# EAGLE schematic bbwmixer (EAGLE 9.6.2)
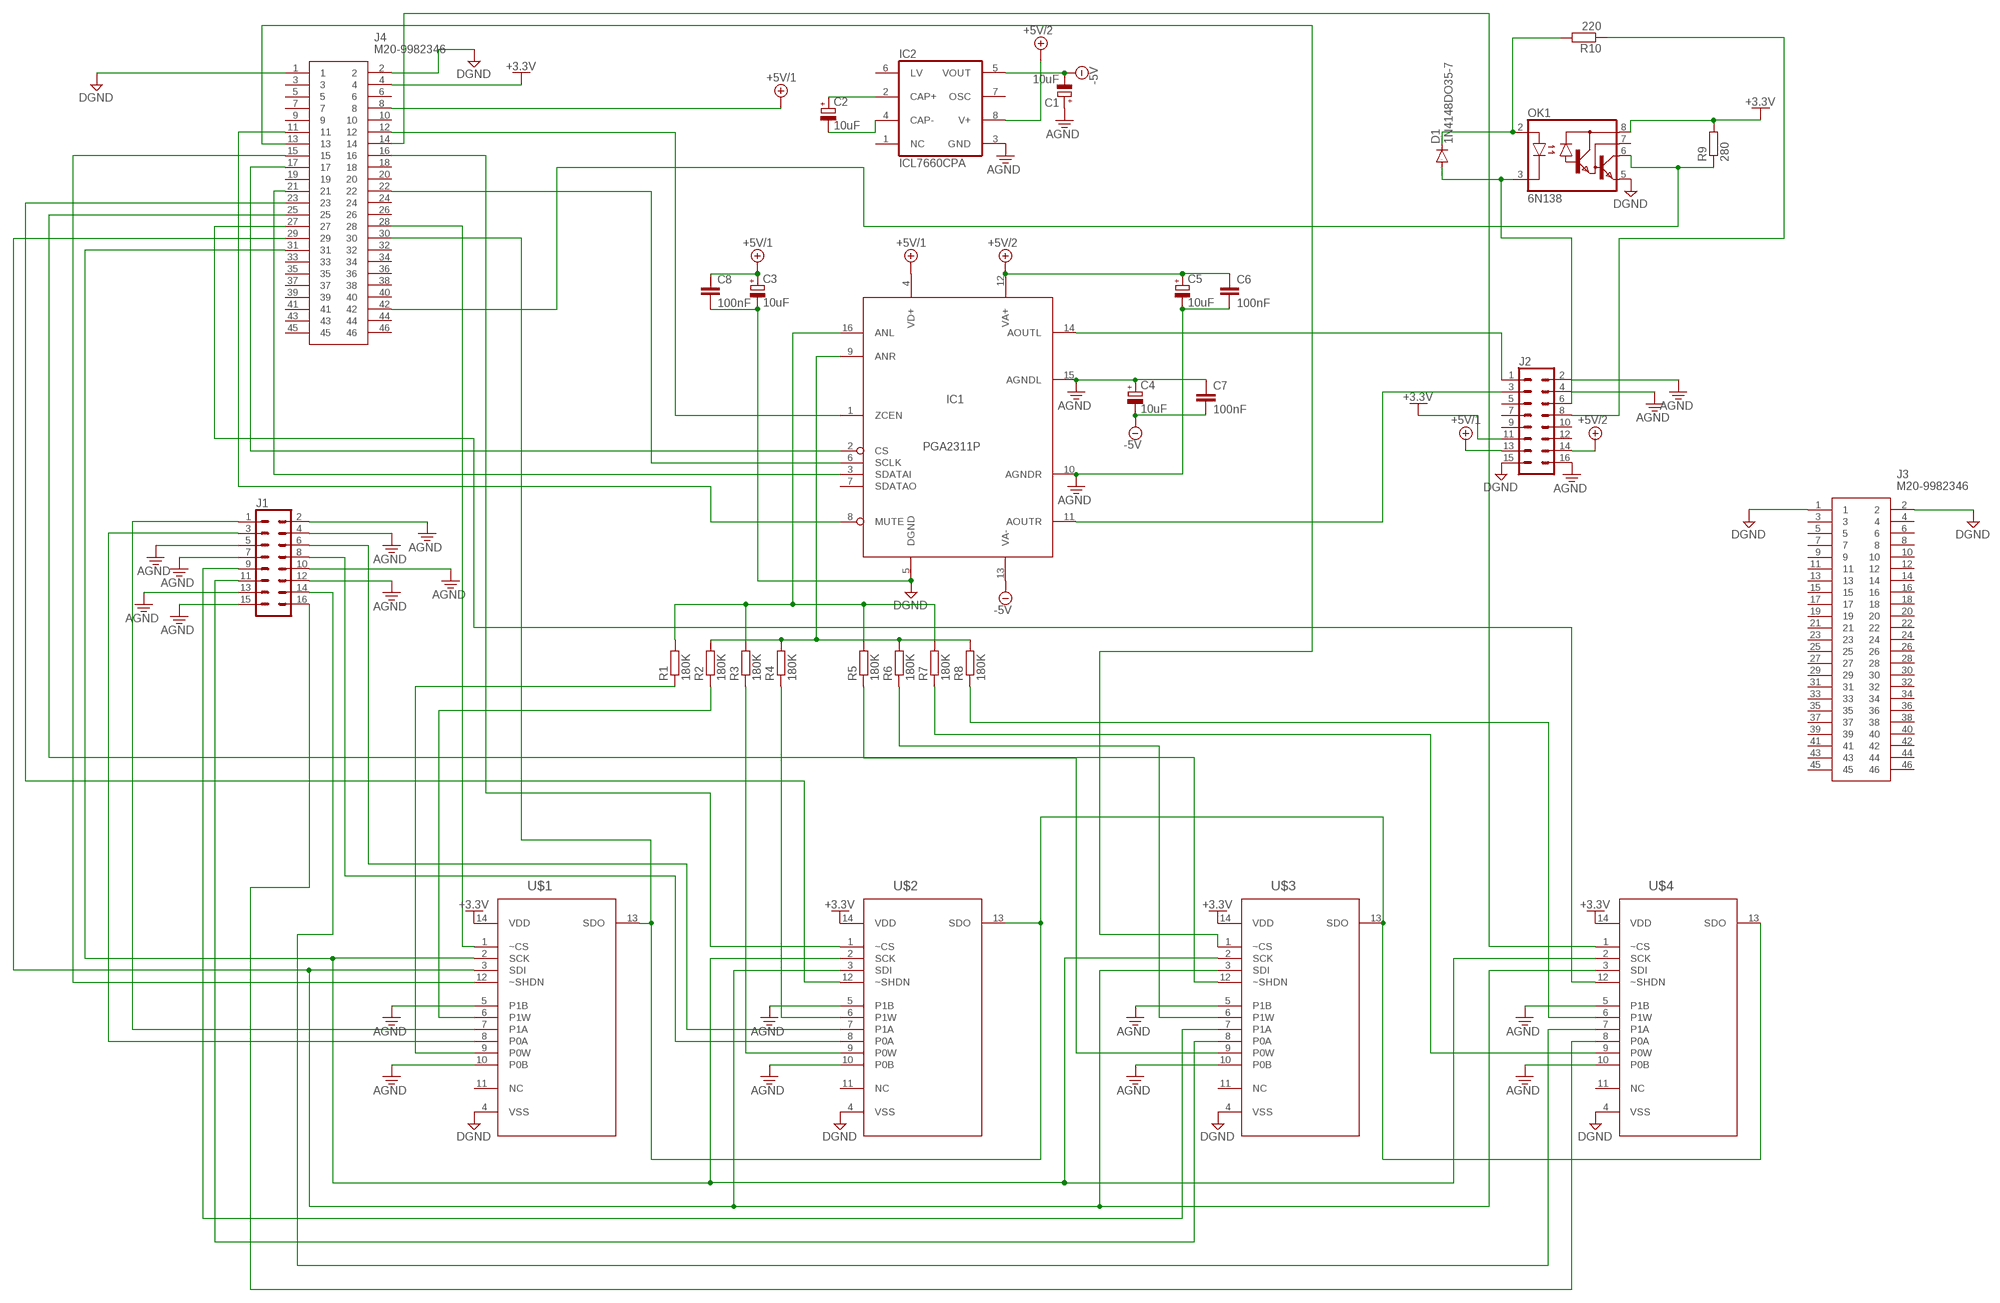
[diagram p0: schematic, sheet 1]

## Parts
C1  10uF  CPOL-EUE15-5AXIAL  [E15-5]
C2  10uF  CPOL-EUE15-5AXIAL  [E15-5]
C3  10uF  CPOL-EUE15-5AXIAL  [E15-5]
C4  10uF  CPOL-EUE15-5AXIAL  [E15-5]
C5  10uF  CPOL-EUE15-5AXIAL  [E15-5]
C6  100nF  C-EU050-025X075  [C050-025X075]
C7  100nF  C-EU050-025X075  [C050-025X075]
C8  100nF  C-EU050-025X075  [C050-025X075]
D1  1N4148DO35-7  [DO35-7]
IC1  PGA2311P  [DIL16]
IC2  ICL7660CPA  [DIL08]
J1  CONN_08X2  [2X8]
J2  CONN_08X2  [2X8]
J3  M20-9982346  [M20-9982346]
J4  M20-9982346  [M20-9982346]
OK1  6N138  [DIL08]
R1  180K  R-EU_0207/10  [0207/10]
R2  180K  R-EU_0207/10  [0207/10]
R3  180K  R-EU_0207/10  [0207/10]
R4  180K  R-EU_0207/10  [0207/10]
R5  180K  R-EU_0207/10  [0207/10]
R6  180K  R-EU_0207/10  [0207/10]
R7  180K  R-EU_0207/10  [0207/10]
R8  180K  R-EU_0207/10  [0207/10]
R9  280  R-EU_0207/10  [0207/10]
R10  220  R-EU_0207/10  [0207/10]
U$1  MCP4251-103E/P  [DIP254P762X533-14]
U$2  MCP4251-103E/P  [DIP254P762X533-14]
U$3  MCP4251-103E/P  [DIP254P762X533-14]
U$4  MCP4251-103E/P  [DIP254P762X533-14]

## Nets
+3.3V: J2.11 J4.4 OK1.8(VCC) R9.2 U$1.14(VDD) U$2.14(VDD) U$3.14(VDD) U$4.14(VDD)
+5V/1: C3.+ C8.1 IC1.4(VD+) J2.13 J4.8
+5V/2 [gordos]: IC1.12(VA+) IC2.8(V+) J2.14
-5V [gordos]: C1.- C4.- C7.2 IC1.13(VA-) IC2.5(VOUT)
AGND [gordos]: C1.+ C4.+ C5.- C6.2 C7.1 IC1.10(AGNDR) IC1.15(AGNDL) IC2.3(GND) J1.2 J1.4 J1.5 J1.7 J1.10 J1.12 J1.13 J1.15 J2.2 J2.4 J2.16 U$1.5(P1B) U$1.10(P0B) U$2.5(P1B) U$2.10(P0B) U$3.5(P1B) U$3.10(P0B) U$4.5(P1B) U$4.10(P0B)
DGND [gordos]: C3.- C8.2 IC1.5(DGND) J2.15 J3.1 J3.2 J4.1 J4.2 OK1.5(GND) U$1.4(VSS) U$2.4(VSS) U$3.4(VSS) U$4.4(VSS)
N$1: C2.+ IC2.2(CAP+)
N$2: C2.- IC2.4(CAP-)
N$4: C5.+ C6.1
N$5: R1.1 U$1.9(P0W)
N$6: R2.1 U$1.6(P1W)
N$7: R3.1 U$2.9(P0W)
N$8: R4.1 U$2.6(P1W)
N$9: R5.1 U$3.9(P0W)
N$10: R6.1 U$3.6(P1W)
N$11: R7.1 U$4.9(P0W)
N$12: R8.1 U$4.6(P1W)
N$13: IC1.16(ANL) R1.2 R3.2 R5.2 R7.2
N$14: IC1.9(ANR) R2.2 R4.2 R6.2 R8.2
N$15: J4.30 U$1.13(SDO) U$2.13(SDO) U$3.13(SDO) U$4.13(SDO)
N$16: J4.31 U$1.2(SCK) U$2.2(SCK) U$3.2(SCK) U$4.2(SCK)
N$17: J1.3 U$1.8(P0A)
N$18: J4.29 U$1.3(SDI) U$2.3(SDI) U$3.3(SDI) U$4.3(SDI)
N$19: J1.1 U$1.7(P1A)
N$20: J1.8 U$2.8(P0A)
N$21: J1.6 U$2.7(P1A)
N$22: J1.9 U$3.7(P1A)
N$23: J1.11 U$3.8(P0A)
N$24: J1.14 U$4.7(P1A)
N$25: J1.16 U$4.8(P0A)
N$26: IC1.14(AOUTL) J2.1
N$27: IC1.11(AOUTR) J2.3
N$30: IC1.2(CS) J4.17
N$31: IC1.3(SDATAI) J4.21
N$32: IC1.6(SCLK) J4.22
N$33: IC1.8(MUTE) J4.11
N$34: IC1.1(ZCEN) J4.12
N$35: J4.15 U$1.12(~SHDN)
N$36: J4.23 U$2.12(~SHDN)
N$37: J4.25 U$3.12(~SHDN)
N$38: J4.27 U$4.12(~SHDN)
N$39: J4.28 U$1.1(~CS)
N$40: J4.16 U$2.1(~CS)
N$41: J4.13 U$3.1(~CS)
N$42: J4.14 U$4.1(~CS)
N$45: J4.42 OK1.6(VO) R9.1
N$46: D1.A J2.6 OK1.3(C)
N$47: D1.C OK1.2(A) R10.2
N$49: J2.8 R10.1
Unconnected: IC1.7(SDATAO) IC2.1(NC) IC2.6(LV) IC2.7(OSC) J2.5 J2.7 J2.9 J2.10 J2.12 J3.3 J3.4 J3.5 J3.6 J3.7 J3.8 J3.9 J3.10 J3.11 J3.12 J3.13 J3.14 J3.15 J3.16 J3.17 J3.18 J3.19 J3.20 J3.21 J3.22 J3.23 J3.24 J3.25 J3.26 J3.27 J3.28 J3.29 J3.30 J3.31 J3.32 J3.33 J3.34 J3.35 J3.36 J3.37 J3.38 J3.39 J3.40 J3.41 J3.42 J3.43 J3.44 J3.45 J3.46 J4.3 J4.5 J4.6 J4.7 J4.9 J4.10 J4.18 J4.19 J4.20 J4.24 J4.26 J4.32 J4.33 J4.34 J4.35 J4.36 J4.37 J4.38 J4.39 J4.40 J4.41 J4.43 J4.44 J4.45 J4.46 OK1.7(VB) U$1.11(NC) U$2.11(NC) U$3.11(NC) U$4.11(NC)

## Library data of the parts
C1-C5 = rcl:CPOL-EU: POLARIZED CAPACITOR, European symbol; SPICEPREFIX: C
C6-C8 = rcl:C-EU: CAPACITOR, European symbol; SPICEPREFIX: C
D1 = diode:1N4148: DIODE high speed (Philips)
IC1 = PGA2311:PGA2311
IC2 = maxim:ICL7660CPA: VOLTAGE CONVERTER; MF: INTERSIL; MPN: ICL7660CPA; OC_FARNELL: 1018170; OC_NEWARK: 06F7441
J1 J2 = SparkFun-Connectors:CONN_08X2: Multi connection point. Often used as Generic Header-pin footprint for 0.1 inch spaced/style header connections You can populate with any combo of single row headers, but if you'd like an exact match, check this: Header - 2x8 (Male, 0.1") <https://www.sparkfun.com/products/13156> (PRT-13156) On any of the 0.1 inch spaced packages, you can populate with these: Break Away Headers - Straight <https://www.sparkfun.com/products/116> (PRT-00116) Break Away Male Headers - Right Angle <https://www.sparkfun.com/products/553> (PRT-00553) Female Headers <https://www.sparkfun.com/products/115> (PRT-00115) Break Away Headers - Machine Pin <https://www.sparkfun.com/products/117> (PRT-00117) Break Away Female Headers - Swiss Machine Pin <https://www.sparkfun.com/products/743> (PRT-00743)
J3 J4 = SamacSys_Parts:M20-9982346: 2.54mm (0.1") Pitch DIL Vertical Throughboard Pin Header, 6.1mm mating pin height, tin, 23+23 contacts Source: Datasheet <https://cdn.harwin.com/pdfs/M20-998.pdf>; DESCRIPTION: 2.54mm (0.1") Pitch DIL Vertical Throughboard Pin Header, 6.1mm mating pin height, tin, 23+23 contacts; HEIGHT: mm; MANUFACTURER_NAME: Harwin; MANUFACTURER_PART_NUMBER: M20-9982346; MOUSER_PART_NUMBER: 855-M20-9982346; MOUSER_PRICE-STOCK: https://www.mouser.co.uk/ProductDetail/Harwin/M20-9982346?qs=vF78I%252BjhbY%2FXqZboSp3B%2Fw%3D%3D
OK1 = optocoupler:6N138: MOTOROLA OPTO COUPLER; MF: VISHAY/TELEFUNKEN; MPN: 6N138; OC_FARNELL: 9860150; OC_NEWARK: 35K5294
R1-R10 = rcl:R-EU_: RESISTOR, European symbol; SPICEPREFIX: R
U$1-U$4 = MCP4251-103E_P:MCP4251-103E/P: Single/Dual SPI Digital POT Check availability <https://pricing.snapeda.com/parts/MCP4251-103E/P/Microchip%20Technology%20/%20Atmel/view-part?ref=eda>; AVAILABILITY: In Stock; DESCRIPTION: Digital Potentiometer ICs Dual 8B V SPI POT; MF: Microchip Technology / Atmel; MP: MCP4251-103E/P; PACKAGE: None; PRICE: None; PURCHASE-URL: https://pricing.snapeda.com/search/part/MCP4251-103E/P/?ref=eda

## Net classes
0 DGND: width 0.152 mm
1 gordos: width 0.406 mm